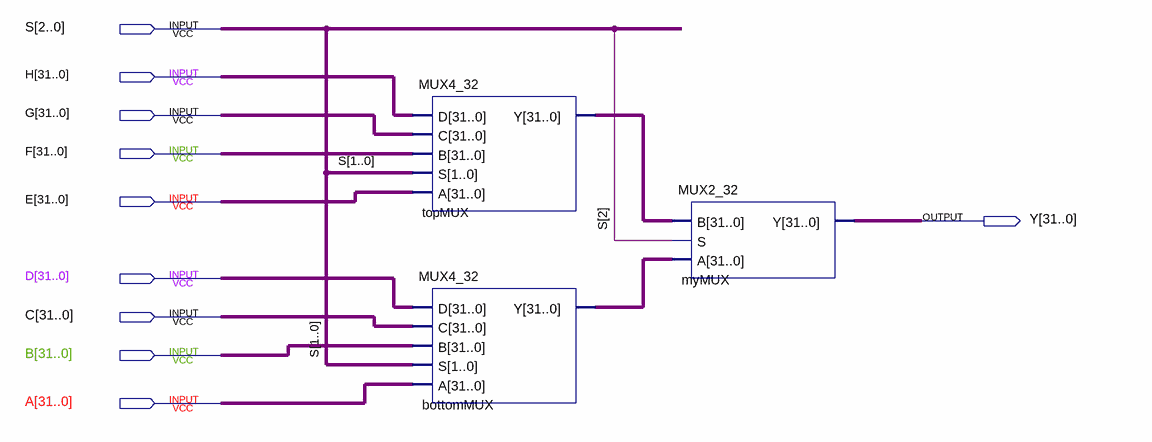
[diagram p0: schematic sheet]
// Quartus schematic MUX8_32.bdf as structural Verilog: 3 symbols, 10 pins
module MUX8_32 (
  input  [2:0] S,
  input  [31:0] H,
  input  [31:0] G,
  input  [31:0] F,
  input  [31:0] E,
  input  [31:0] D,
  input  [31:0] C,
  input  [31:0] B,
  input  [31:0] A,
  output [31:0] Y
);

  wire [31:0] bottomMUX_y, topMUX_y;

  MUX4_32 topMUX (.D(H), .C(G), .B(F), .S(S[1:0]), .A(E), .Y(topMUX_y));
  MUX4_32 bottomMUX (.D(D), .C(C), .B(B), .S(S[1:0]), .A(A), .Y(bottomMUX_y));
  MUX2_32 myMUX (.B(topMUX_y), .S(S[2]), .A(bottomMUX_y), .Y(Y));
endmodule
